# Altium schematic sheet esp32s3_nano.SchDoc
size Letter; SheetNumber: 3; SheetTotal: 3
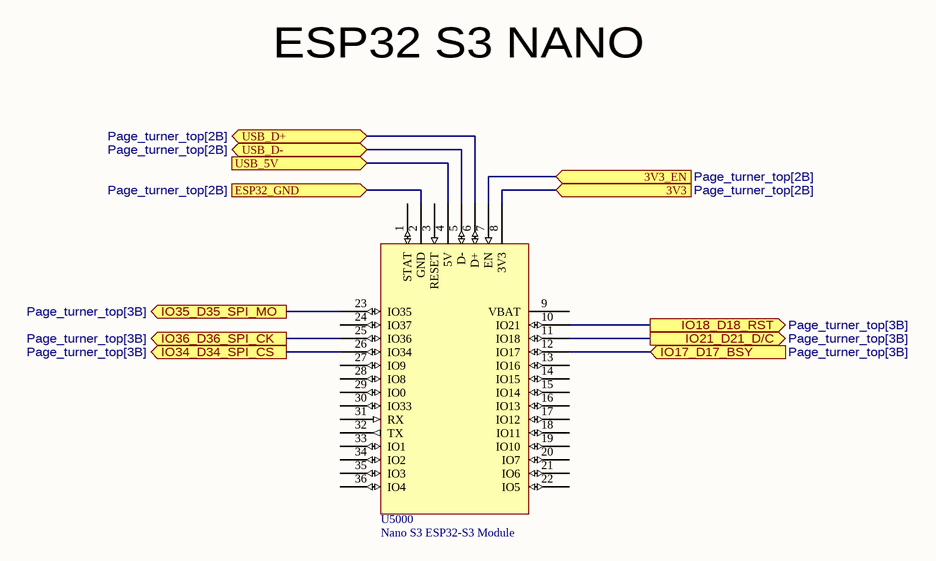
[diagram p0: esp32s3_nano.SchDoc]

## Parts
U5000  Nano S3 ESP32-S3 Module  [NanoS3]

## Ports
3V3 (in, see Page_turner_top[2B]), 3V3_EN (in, see Page_turner_top[2B]), ESP32_GND (in, see Page_turner_top[2B]), IO17_D17_BSY (in, see Page_turner_top[3B]), IO18_D18_RST (out, see Page_turner_top[3B]), IO21_D21_D/C (out, see Page_turner_top[3B]), IO34_D34_SPI_CS (out, see Page_turner_top[3B]), IO35_D35_SPI_MO (out, see Page_turner_top[3B]), IO36_D36_SPI_CK (out, see Page_turner_top[3B]), USB_5V (in), USB_D+ (bidir, see Page_turner_top[2B]), USB_D- (bidir, see Page_turner_top[2B])

## Nets
3V3: U5000.8(3V3) ; port 3V3
3V3_EN: U5000.7(EN) ; port 3V3_EN
ESP32_GND: U5000.2(GND) ; port ESP32_GND
IO17_D17_BSY: U5000.12(IO17) ; port IO17_D17_BSY
IO18_D18_RST: U5000.10(IO21) ; port IO18_D18_RST
IO21_D21_D/C: U5000.11(IO18) ; port IO21_D21_D/C
IO34_D34_SPI_CS: U5000.26(IO34) ; port IO34_D34_SPI_CS
IO35_D35_SPI_MO: U5000.23(IO35) ; port IO35_D35_SPI_MO
IO36_D36_SPI_CK: U5000.25(IO36) ; port IO36_D36_SPI_CK
USB_5V: U5000.4(5V) ; port USB_5V
USB_D+: U5000.6(D+) ; port USB_D+
USB_D-: U5000.5(D-) ; port USB_D-

Not connected (* = marked no-connect by the designer): U5000 1(STAT) 3(RESET) 9(VBAT) 13(IO16) 14(IO15) 15(IO14) 16(IO13) 17(IO12) 18(IO11) 19(IO10) 20(IO7) 21(IO6) 22(IO5) 24(IO37) 27(IO9) 28(IO8) 29(IO0) 30(IO33) 31(RX) 32(TX) 33(IO1) 34(IO2) 35(IO3) 36(IO4)

## Notes on the sheet
- ESP32 S3 NANO

## Library data of the parts
U5000 = NanoS3: Manufacturer 1: Unexpected Maker; Manufacturer Part Number 1: *